# EasyEDA Pro project PRJ_Feeder_V01c.epro, schematic Feeder_Host

## Sheets
1 MCU: Board Name: HostBoard; Create Date: 2025-01-09; Page Name: MCU; Project Name: Orion-Feeder; Schematic Name: Feeder_Host; Update Date: 2025-03-19; Company: Orion Electronics; Drawn: Giovanni C.; Page Size: A4; Version: V0.1d
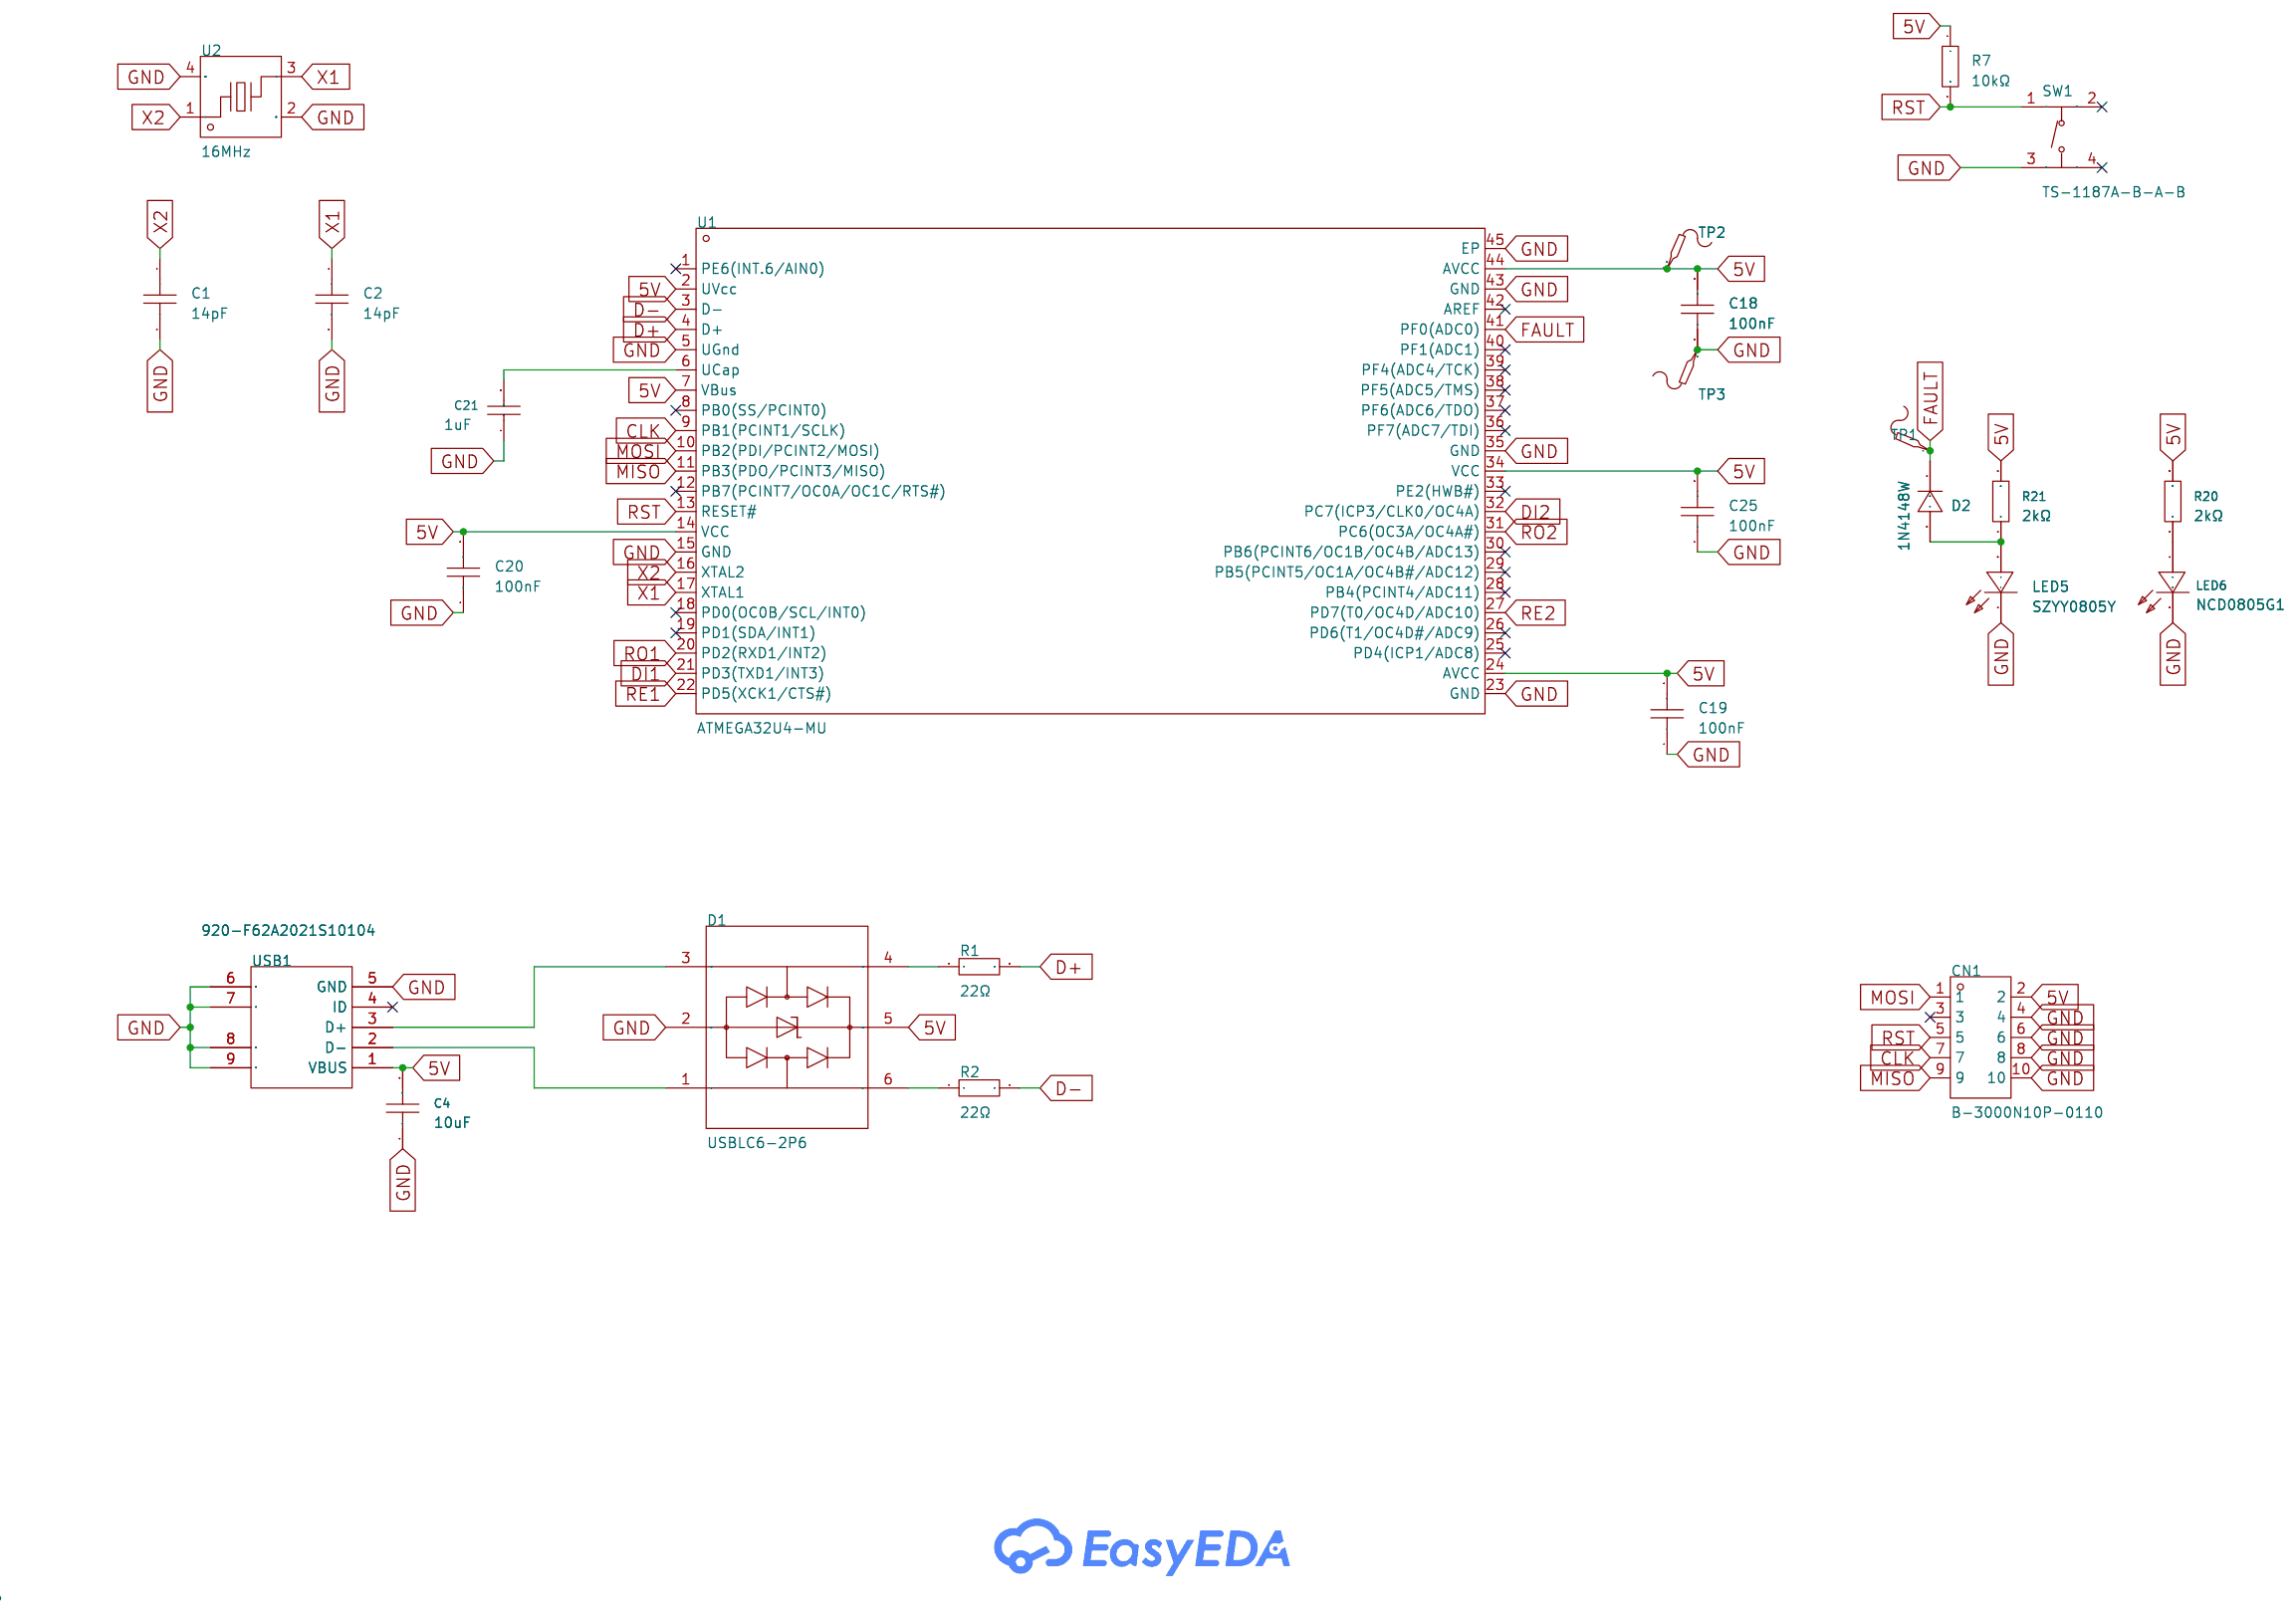
[diagram p2: MCU]
2 485: Page Name: 485; Update Date: 2025-03-21
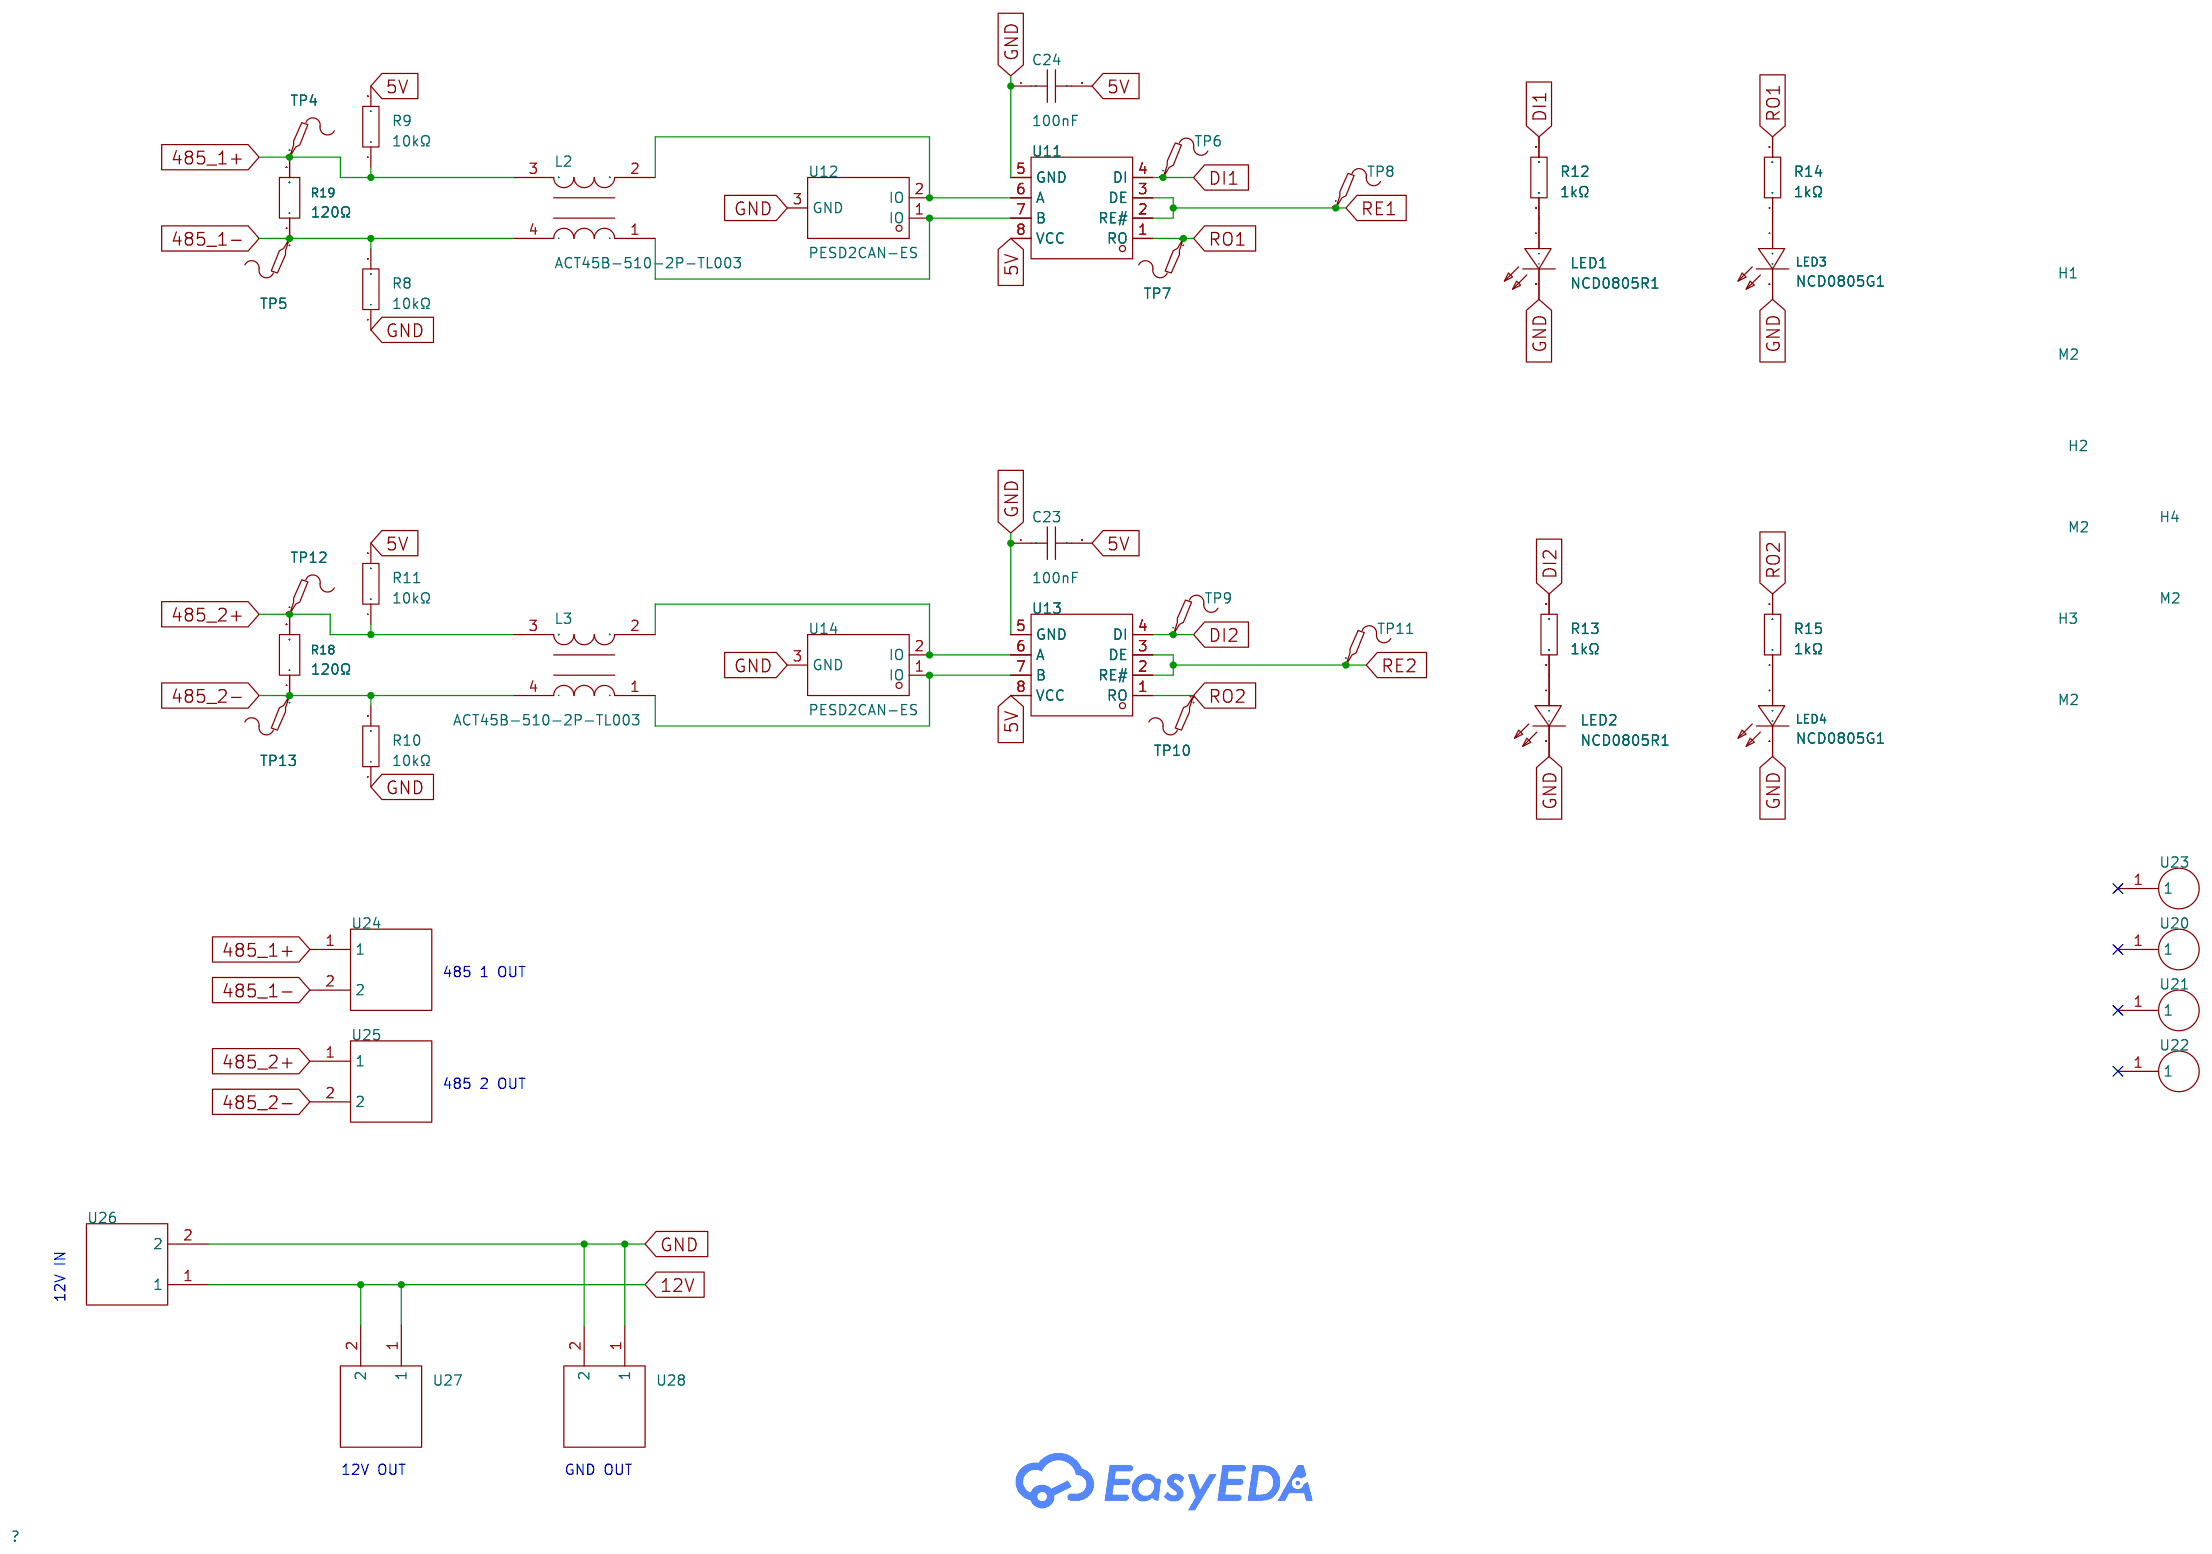
[diagram p3: 485]

## Parts
sheet 485
C23  100nF  [C0402]
C24  100nF  [C0402]
H1  M2  [M2]
H2  M2  [M2]
H3  M2  [M2]
H4  M2  [M2]
L2  ACT45B-510-2P-TL003  [IND-SMD_4P-L4.5-W3.2-TL]
L3  ACT45B-510-2P-TL003  [IND-SMD_4P-L4.5-W3.2-TL]
LED1  NCD0805R1  [LED0805-R-RD]
LED2  NCD0805R1  [LED0805-R-RD]
LED3  NCD0805G1  [LED0805-R-RD]
LED4  NCD0805G1  [LED0805-R-RD]
R8  10kΩ  [R0402]
R9  10kΩ  [R0402]
R10  10kΩ  [R0402]
R11  10kΩ  [R0402]
R12  1kΩ  [R0402]
R13  1kΩ  [R0402]
R14  1kΩ  [R0402]
R15  1kΩ  [R0402]
R18  120Ω  [R0402]
R19  120Ω  [R0402]
TP4  -  [Test-Point-0.5mm]
TP5  -  [Test-Point-0.5mm]
TP6  -  [Test-Point-0.5mm]
TP7  -  [Test-Point-0.5mm]
TP8  -  [Test-Point-0.5mm]
TP9  -  [Test-Point-0.5mm]
TP10  -  [Test-Point-0.5mm]
TP11  -  [Test-Point-0.5mm]
TP12  -  [Test-Point-0.5mm]
TP13  -  [Test-Point-0.5mm]
U11  MAX1487EDTR(XBLW)  [SOP-8_L4.9-W3.9-P1.27-LS6.0-BL]
U12  PESD2CAN-ES  [SOT-23-3_L2.9-W1.3-P1.90-LS2.4-BR]
U13  MAX1487EDTR(XBLW)  [SOP-8_L4.9-W3.9-P1.27-LS6.0-BL]
U14  PESD2CAN-ES  [SOT-23-3_L2.9-W1.3-P1.90-LS2.4-BR]
U20  -  [FID_CUST]
U21  -  [FID_CUST]
U22  -  [FID_CUST]
U23  -  [FID_CUST]
U24  -  [Wago 2060-472/998-404]
U25  -  [Wago 2060-472/998-404]
U26  -  [Wago 2060-472/998-404]
U27  -  [Wago 2060-472/998-404]
U28  -  [Wago 2060-472/998-404]
sheet MCU
C1  14pF  [C0805]
C2  14pF  [C0805]
C4  10uF  [C0603]
C18  100nF  [C0402]
C19  100nF  [C0402]
C20  100nF  [C0402]
C21  1uF  [C0805]
C25  100nF  [C0402]
CN1  B-3000N10P-0110  [CONN-SMD_10P-P2.54_B-3000N10P-0110]
D1  USBLC6-2P6  [SOT-666-6_L1.6-W1.2-P0.50-LS1.6-BR]
D2  1N4148W  [SOD-123_L2.8-W1.8-LS3.7-RD]
LED5  SZYY0805Y  [LED0805-RD_YELLOW]
LED6  NCD0805G1  [LED0805-R-RD]
R1  22Ω  [R0805]
R2  22Ω  [R0805]
R7  10kΩ  [R0402]
R20  2kΩ  [R0805]
R21  2kΩ  [R0805]
SW1  TS-1187A-B-A-B  [SW-SMD_4P-L5.1-W5.1-P3.70-LS6.5-TL_H1.5]
TP1  -  [Test-Point-0.5mm]
TP2  -  [Test-Point-0.5mm]
TP3  -  [Test-Point-0.5mm]
U1  ATMEGA32U4-MU  [VQFN-44_L7.0-W7.0-P0.50-BL-EP5.2]
U2  16MHz  [CRYSTAL-SMD_4P-L2.0-W1.6-BL]
USB1  920-F62A2021S10104  [MINI-USB-SMD_920-F62A2021S10104]

## Library data of the parts
C18-C20 C23-C25 = 0402X104K500CT: Capacitance: Tolerance:±10% Tolerance:±10% Voltage Rated: Temperature Coefficient:; LCSC Part Name: 100nF ±10% 50V; Supplier Part: C387959; Manufacturer: Walsin(华新科); Supplier Footprint: 0402; JLCPCB Part Class: Extended Part; Datasheet: https://atta.szlcsc.com/upload/public/pdf/source/20190524/C388053_0CD3F469255EF43E616A57DAC128F58D.pdf; Supplier: LCSC; Tolerance: ±10%
H1-H4 = M2
L2 L3 = ACT45B-510-2P-TL003: Number of Lines:2 Withstanding Voltage:250V@2secs Current Rating:200mA Inductance @ Frequency:51uH@100kHz Voltage Rating - DC:50V Voltage Rating:- Impedance @ Frequency:2.8kΩ@10MHz DC Resistance (DCR):1Ω Operating Temperature:-40℃~+150℃ Operating Temperat; LCSC Part Name: 两路 4532共模滤波器 阻抗2.8kΩ@10MHz; Supplier Part: C76584; Manufacturer: TDK; Supplier Footprint: SMD,4.5x3.2mm; JLCPCB Part Class: Extended Part; Datasheet: https://atta.szlcsc.com/upload/public/pdf/source/20160918/1474166842057.pdf; Supplier: LCSC; Number of Lines: 2; Withstanding Voltage: 250V@2secs; Current Rating: 200mA; Inductance @ Frequency: 51uH@100kHz; Voltage Rating - DC: 50V; Impedance @ Frequency: 2.8kΩ@10MHz; DC Resistance (DCR): 1Ω; Operating Temperature: -40℃~+150℃
LED1 LED2 = NCD0805R1_C84256: Lamp Holder Type:- Emitted Color:Red Forward Voltage (VF):1.6V~2.6V Forward Voltage (VF):1.6V~2.6V Power Dissipation:65mW Forward Current:20mA Dominant Wavelength:615nm~630nm Dominant Wavelength:615nm~630nm Peak Wavelength:- Diode Configuration:独立二极管 Lens; Supplier Part: C84256; Manufacturer: 国星光电; Supplier Footprint: 0805; JLCPCB Part Class: Basic Part; Datasheet: https://atta.szlcsc.com/upload/public/pdf/source/20200820/C84256_F0A75A43B3EAD75808600A0514C76B99.pdf; Supplier: LCSC; Emitted Color: Red; Forward Voltage (VF): 1.6V~2.6V; Power Dissipation: 65mW; Forward Current: 20mA; Dominant Wavelength: 615nm~630nm; Diode Configuration: 独立二极管; Lens Color: 无色透明透镜; Luminous Intensity: 67mcd~195mcd; Viewing Angle: 130°; Operating Temperature: -30℃~+85℃
LED3 LED4 LED6 = NCD0805G1: Emitted Color:Emerald Forward Voltage (VF):2.5V~3.6V Forward Voltage (VF):2.5V~3.6V Power Dissipation:72mW Forward Current:5mA Dominant Wavelength:525nm~537.5nm Dominant Wavelength:525nm~537.5nm Lens Color:无色透明透镜 Luminous Intensity:180mcd~400mcd Luminous; Supplier Part: C84260; Manufacturer: 国星光电; Supplier Footprint: 0805; JLCPCB Part Class: Extended Part; Datasheet: https://atta.szlcsc.com/upload/public/pdf/source/20200820/C84260_AFC7BF57C6FBA034D182BB8D10A67EFE.pdf; Supplier: LCSC; Emitted Color: Emerald; Forward Voltage (VF): 2.5V~3.6V; Power Dissipation: 72mW; Forward Current: 5mA; Dominant Wavelength: 525nm~537.5nm; Lens Color: 无色透明透镜; Luminous Intensity: 180mcd~400mcd; Viewing Angle: 130°; Operating Temperature: -30℃~+85℃
R7-R11 = RC0402FR-0710KL: Type:Thick Film Resistors Resistance: Tolerance:±1% Tolerance:±1% Power(Watts): Overload Voltage (Max): Temperature Coefficient:±100ppm/℃ Temperature Coefficient:±100ppm/℃ Operating Temperature Range:-55℃~+155℃ Operating Temperature Range:-55℃~+155℃; LCSC Part Name: 厚膜电阻 10kΩ ±1% 62.5mW; Supplier Part: C60490; Manufacturer: YAGEO(国巨); Supplier Footprint: 0402; JLCPCB Part Class: Extended Part; Datasheet: https://atta.szlcsc.com/upload/public/pdf/source/20170925/C131467_1506321478108990263.pdf; Supplier: LCSC; Type: Thick Film Resistors; Tolerance: ±1%; Temperature Coefficient: ±100ppm/℃; Operating Temperature Range: -55℃~+155℃
R12-R15 = RC0402FR-071KL: Type:Thick Film Resistors Resistance: Tolerance:±1% Tolerance:±1% Power(Watts): Overload Voltage (Max): Temperature Coefficient:±100ppm/℃ Temperature Coefficient:±100ppm/℃ Operating Temperature Range:-55℃~+155℃ Operating Temperature Range:-55℃~+155℃; LCSC Part Name: 厚膜电阻 1kΩ ±1% 62.5mW; Supplier Part: C106235; Manufacturer: YAGEO(国巨); Supplier Footprint: 0402; JLCPCB Part Class: Extended Part; Datasheet: https://atta.szlcsc.com/upload/public/pdf/source/20180927/C295883_E8D83085EA81BD7DE0B2B681138C15EE.pdf; Supplier: LCSC; Type: Thick Film Resistors; Tolerance: ±1%; Temperature Coefficient: ±100ppm/℃; Operating Temperature Range: -55℃~+155℃
R18 R19 = ERJ2GEJ121X: Type:Thick Film Resistors Resistance: Tolerance:±5% Tolerance:±5% Power(Watts): Overload Voltage (Max):- Temperature Coefficient:±200ppm/℃ Temperature Coefficient:±200ppm/℃ Operating Temperature Range:-55℃~+155℃ Operating Temperature Range:-55℃~+155℃; LCSC Part Name: 120Ω ±5% 100mW 厚膜电阻; Supplier Part: C412974; Manufacturer: PANASONIC(松下); Supplier Footprint: 0402; JLCPCB Part Class: Extended Part; Datasheet: https://atta.szlcsc.com/upload/public/pdf/source/20190820/C412974_078D0C135EE48A01219A288E454FDF0F.pdf; Supplier: LCSC; Type: Thick Film Resistors; Tolerance: ±5%; Temperature Coefficient: ±200ppm/℃; Operating Temperature Range: -55℃~+155℃
TP1-TP13 = Test-Point: Test Point 测试点
U11 U13 = MAX1487EDTR(XBLW): LCSC Part Name: XBLW MAX1487 12 Mbps通信收发器; Supplier Part: C41369526; Manufacturer: XBLW(芯伯乐); Supplier Footprint: SOP-8; Datasheet: https://atta.szlcsc.com/upload/public/pdf/source/20240826/373ADB85BB75A28C97F383EDEA6A9A3C.pdf; Supplier: LCSC
U12 U14 = PESD2CAN-ES: polarity:Bidirectional Reverse Stand-Off Voltage (Vrwm):24V Maximum Clamping Voltage:48V Peak Pulse Current (Ipp):8A Peak Pulse Power Dissipation (Ppp):450W Breakdown Voltage:26.5V Reverse Leakage Current (Ir):1uA Number of Lines:Dual channel Operating Te; LCSC Part Name: CAN 防护，两路双向ESD静电防护器件，30kV，CJ：15pF；CAN/CANFD/12V、24V电源防护; Supplier Part: C5180299; Manufacturer: ElecSuper(静芯微); Supplier Footprint: SOT-23; JLCPCB Part Class: Extended Part; Datasheet: https://atta.szlcsc.com/upload/public/pdf/source/20240905/8813EF6117DE3CA11E16DC4758DF48B3.pdf; Supplier: LCSC; polarity: Bidirectional; Reverse Stand-Off Voltage (Vrwm): 24V; Maximum Clamping Voltage: 48V; Peak Pulse Current (Ipp): 8A; Peak Pulse Power Dissipation (Ppp): 450W; Breakdown Voltage: 26.5V; Reverse Leakage Current (Ir): 1uA; Number of Lines: Dual channel; Type: ESD
U20-U23 = FID_CUST: Custom 1MM fiducial
U24-U28 = WAGO 2060-472/998-404
C1 C2 = CAP_0805: Supplier Footprint: 0805; LCSC Part Name: C519919; Manufacturer Part: CC0805JRNPO9BN140
C4 = GRM188R61E106KA73D: Capacitance: Tolerance:±10% Tolerance:±10% Voltage Rated: Temperature Coefficient:; LCSC Part Name: 10uF ±10% 25V; Supplier Part: C344022; Manufacturer: muRata(村田); Supplier Footprint: 0603; JLCPCB Part Class: Extended Part; Datasheet: https://atta.szlcsc.com/upload/public/pdf/source/20181211/C344022_BB98D43E7DA95E5A749FBFE073C8A3E0.pdf; Supplier: LCSC; Tolerance: ±10%
C21 = CL21B105KOFNNNE: Capacitance: Tolerance:±10% Tolerance:±10% Voltage Rated: Temperature Coefficient:; LCSC Part Name: 1uF ±10% 16V; Supplier Part: C24123; Manufacturer: SAMSUNG(三星); Supplier Footprint: 0805; JLCPCB Part Class: Extended Part; Datasheet: https://atta.szlcsc.com/upload/public/pdf/source/20160218/1457707763339.pdf; Supplier: LCSC; Tolerance: ±10%
CN1 = B-3000N10P-0110: Connector Type:简牛座 Pitch:2.54mm Structure:2x5P Holder Type:Brick nogging Row Spacing:2.54mm Number of Rows:2 Pin Number in each Row:5 Contact Material:Brass Contact Plating:-; LCSC Part Name: 2.54mm 2x5P 排数:2 每排P数:5; Supplier Part: C383605; Manufacturer: Ckmtw(灿科盟); Supplier Footprint: SMD,P=2.54mm; JLCPCB Part Class: Extended Part; Datasheet: https://atta.szlcsc.com/upload/public/pdf/source/20210819/EF893D1E70FA66E68F7407481BD50F8A.pdf; Supplier: LCSC; Connector Type: 简牛座; Pitch: 2.54mm; Structure: 2x5P; Holder Type: Brick nogging; Row Spacing: 2.54mm; Number of Rows: 2; Pin Number in each Row: 5; Contact Material: Brass
D1 = USBLC6-2P6_C15999: polarity:Unidirectional Reverse Stand-Off Voltage (Vrwm):5.25V Maximum Clamping Voltage:17V Peak Pulse Current (Ipp):5A Breakdown Voltage:6V Number of Lines:Dual channel Type:ESD; LCSC Part Name: 单向ESD; Supplier Part: C15999; Manufacturer: ST(意法半导体); Supplier Footprint: SOT-666-6; JLCPCB Part Class: Extended Part; Datasheet: https://atta.szlcsc.com/upload/public/pdf/source/20140724/1457707160627.pdf; Supplier: LCSC; polarity: Unidirectional; Reverse Stand-Off Voltage (Vrwm): 5.25V; Maximum Clamping Voltage: 17V; Peak Pulse Current (Ipp): 5A; Breakdown Voltage: 6V; Number of Lines: Dual channel; Type: ESD
D2 = 1N4148W_C84367: Diode Configuration: Forward Voltage (Vf@If):1.5V@300mA Reverse Voltage (Vr): Rectified Current: Reverse Leakage Current:25nA@20V Reverse Recovery Time (trr): Operating Temperature:- Operating Temperature:-; LCSC Part Name: 电压:100V 电流:300mA; Supplier Part: C84367; Manufacturer: MDD(辰达半导体); Supplier Footprint: SOD-123; JLCPCB Part Class: Extended Part; Datasheet: https://atta.szlcsc.com/upload/public/pdf/source/20230823/B01BF36E6140A0359364F9F682D146D6.pdf; Supplier: LCSC; Forward Voltage (Vf@If): 1.5V@300mA; Reverse Leakage Current: 25nA@20V
LED5 = SZYY0805Y: Emitted Color:Yellow Power Dissipation:40mW Forward Current:10mA Dominant Wavelength:584nm~594nm Dominant Wavelength:584nm~594nm Peak Wavelength:596nm Diode Configuration:- Lens Color:无色透明透镜 Color Temperature:- Color Temperature:- Viewing Angle:120° Mount; LCSC Part Name: 黄灯; Supplier Part: C434436; Manufacturer: yongyu(永裕光电); Supplier Footprint: 0805; JLCPCB Part Class: Extended Part; Datasheet: https://atta.szlcsc.com/upload/public/pdf/source/20191204/C434436_DD3F69F670EA5C3EF8F92D3BC1EA8D03.pdf; Supplier: LCSC; Emitted Color: Yellow; Power Dissipation: 40mW; Forward Current: 10mA; Dominant Wavelength: 584nm~594nm; Peak Wavelength: 596nm; Lens Color: 无色透明透镜; Viewing Angle: 120°; Operating Temperature: -40℃~+85℃
R1 R2 = RC0805JR-0722RL: Type:Thick Film Resistors Resistance: Tolerance:±5% Tolerance:±5% Power(Watts): Overload Voltage (Max): Temperature Coefficient:±100ppm/℃ Temperature Coefficient:±100ppm/℃ Operating Temperature Range:-55℃~+155℃ Operating Temperature Range:-55℃~+155℃; LCSC Part Name: 厚膜电阻 22Ω ±5% 125mW; Supplier Part: C108406; Manufacturer: YAGEO(国巨); Supplier Footprint: 0805; JLCPCB Part Class: Extended Part; Datasheet: https://atta.szlcsc.com/upload/public/pdf/source/20180821/C275644_0D56F95EFF785E7D9A1FEF436B37DA78.pdf; Supplier: LCSC; Type: Thick Film Resistors; Tolerance: ±5%; Temperature Coefficient: ±100ppm/℃; Operating Temperature Range: -55℃~+155℃
R20 R21 = 0805W8F2001T5E: Type:Thick Film Resistors Resistance:2kΩ Tolerance:±1% Tolerance:±1% Power(Watts): Overload Voltage (Max): Temperature Coefficient:±100ppm/℃ Temperature Coefficient:±100ppm/℃ Operating Temperature Range:-55℃~+155℃ Operating Temperature Range:-55℃~+155℃; LCSC Part Name: 2kΩ ±1% 125mW 厚膜电阻; Supplier Part: C17604; Manufacturer: UNI-ROYAL(厚声); Supplier Footprint: 0805; JLCPCB Part Class: Basic Part; Datasheet: https://atta.szlcsc.com/upload/public/pdf/source/20200306/C422600_1E6D84923E4A46A82E41ADD87F860B5C.pdf; Supplier: LCSC; Type: Thick Film Resistors; Tolerance: ±1%; Temperature Coefficient: ±100ppm/℃; Operating Temperature Range: -55℃~+155℃
SW1 = TS-1187A-B-A-B: Circuit:SPST Actuator Style:Round Button Operating Force:160gf Mounting Style:Brick nogging Switch Length:5.1mm Switch Width:5.1mm Switch Height:1.5mm Strike Gundam:不带 Contact Current:50mA Voltage Rating (DC):12V Insulation Resistance:- Actuator/Cap Color; LCSC Part Name: 5.1*5.1*1.5mm 立贴 轻触开关; Supplier Part: C318884; Manufacturer: XKB Connectivity(中国星坤); Supplier Footprint: SMD; JLCPCB Part Class: Basic Part; Datasheet: https://atta.szlcsc.com/upload/public/pdf/source/20200227/C318890_053E50208A88A7BA1965D8746000774E.pdf; Supplier: LCSC; Circuit: SPST; Actuator Style: Round Button; Operating Force: 160gf; Mounting Style: Brick nogging; Switch Length: 5.1mm; Switch Width: 5.1mm; Switch Height: 1.5mm; Strike Gundam: 不带; Contact Current: 50mA; Voltage Rating (DC): 12V; Actuator/Cap Color: 金色; With Lamp: No; Mechanical Life: 10万次; Operating Temperature: -30℃~+85℃
U1 = ATMEGA32U4-MU: CPU Core:AVR Program Storage Size:32KB RAM Size:2.5KB GPIO Ports Number:26 Operating Voltage Range:2.7V~5.5V Operating Voltage Range:2.7V~5.5V CPU Maximum Speed:16MHz Program Memory Type:FLASH EEPROM:1KB Operating Temperature Range:-40℃~+85℃ Operating Tem; Supplier Part: C112161; Manufacturer: MICROCHIP(美国微芯); Supplier Footprint: VQFN-44-EP(7x7); JLCPCB Part Class: Extended Part; Datasheet: https://atta.szlcsc.com/upload/public/pdf/source/20170515/1494827289828.pdf; Supplier: LCSC; CPU Core: AVR; Program Storage Size: 32KB; RAM Size: 2.5KB; GPIO Ports Number: 26; Operating Voltage Range: 2.7V~5.5V; CPU Maximum Speed: 16MHz; Program Memory Type: FLASH; EEPROM: 1KB; Operating Temperature Range: -40℃~+85℃; ADC (Bit): 10bit; Universal Serial Bus: 有; Peripheral/Function: WDT；PWM；WDT；PWM; Watchdog: 有; Low-Voltage Detect: 有; Internal Oscillator: 有
U2 = X201616MOB4SI: Crystal Type:Surface Mount Crystal Frequency: Normal temperature Frequency Tolerance:±10ppm Normal temperature Frequency Tolerance:±10ppm External load capacitor: Frequency Stability(Full temperature range):±20ppm Frequency Stability(Full temperature rang; LCSC Part Name: 16MHz ±10ppm 12pF; Supplier Part: C2682778; Manufacturer: YXC(扬兴晶振); Supplier Footprint: SMD2016-4P; JLCPCB Part Class: Extended Part; Datasheet: https://atta.szlcsc.com/upload/public/pdf/source/20240329/C26C9A15A73CBCFBF373B30A8E126750.pdf; Supplier: LCSC; Crystal Type: Surface Mount Crystal; Normal temperature Frequency Tolerance: ±10ppm; Frequency Stability(Full temperature range): ±20ppm
USB1 = 920-F62A2021S10104: Connector Type:Micro-B Standard:USB 2.0 Gender:Female Number of Ports:1 Number of Contacts:5P Mounting Style:Sink board Current Rating - Power (Max):- Operating Temperature Range:-30℃~+80℃ Operating Temperature Range:-30℃~+80℃; LCSC Part Name: Micro-B 母 沉板; Supplier Part: C2763184; Manufacturer: 精拓金; Supplier Footprint: SMD; JLCPCB Part Class: Extended Part; Datasheet: https://atta.szlcsc.com/upload/public/pdf/source/20210526/C2763184_A4A31A8A3654792FCCA6A1F5A5406E81.pdf; Supplier: LCSC; Connector Type: Micro-B; Standard: USB 2.0; Gender: Female; Number of Ports: 1; Number of Contacts: 5P; Mounting Style: Sink board; Operating Temperature Range: -30℃~+80℃

## Nets
5V: C4.2 C18.2 C19.2 C20.2 C23.2 C24.2 C25.2 CN1.2 D1.5(VBUS) R7.1 R9.2 R11.2 R20.2 R21.2 TP2.1 U1.2(UVcc) U1.7(VBus) U1.14(VCC) U1.24(AVCC) U1.34(VCC) U1.44(AVCC) U11.8(VCC) U13.8(VCC) USB1.1(VBUS)
12V: U26.1 U27.1 U27.2
GND: C1.2 C2.2 C4.1 C18.1 C19.1 C20.1 C21.1 C23.1 C24.1 C25.1 CN1.4 CN1.6 CN1.8 CN1.10 D1.2(GND) LED1.2(-) LED2.2(-) LED3.2(K) LED4.2(K) LED5.1(-) LED6.2(K) R8.1 R10.1 SW1.3(C) TP3.1 U1.5(UGnd) U1.15(GND) U1.23(GND) U1.35(GND) U1.43(GND) U1.45(EP) U2.2(GND) U2.4(GND) U11.5(GND) U12.3(GND) U13.5(GND) U14.3(GND) U26.2 U28.1 U28.2 USB1.5(GND) USB1.6(EH) USB1.7(EH) USB1.8(EH) USB1.9(EH)
485_1+: L2.3 R9.1 R19.2 TP4.1 U24.1
485_1-: L2.4 R8.2 R19.1 TP5.1 U24.2
485_2+: L3.3 R11.1 R18.2 TP12.1 U25.1
485_2-: L3.4 R10.2 R18.1 TP13.1 U25.2
CLK: CN1.7 U1.9(PB1(PCINT1/SCLK))
D+: R1.2 U1.4(D+)
D-: R2.2 U1.3(D-)
DI1: R12.2 TP6.1 U1.21(PD3(TXD1/INT3)) U11.4(DI)
DI2: R13.2 TP9.1 U1.32(PC7(ICP3/CLK0/OC4A)) U13.4(DI)
FAULT: D2.1(C) TP1.1 U1.41(PF0(ADC0))
MISO: CN1.9 U1.11(PB3(PDO/PCINT3/MISO))
MOSI: CN1.1 U1.10(PB2(PDI/PCINT2/MOSI))
RE1: TP8.1 U1.22(PD5(XCK1/CTS#)) U11.2(RE#) U11.3(DE)
RE2: TP11.1 U1.27(PD7(T0/OC4D/ADC10)) U13.2(RE#) U13.3(DE)
RO1: R14.2 TP7.1 U1.20(PD2(RXD1/INT2)) U11.1(RO)
RO2: R15.2 TP10.1 U1.31(PC6(OC3A/OC4A#)) U13.1(RO)
RST: CN1.5 R7.2 SW1.1(A) U1.13(RESET#)
X1: C2.1 U1.17(XTAL1) U2.3
X2: C1.1 U1.16(XTAL2) U2.1
$1N1505: D1.3(I/O2) USB1.3(D+)
$1N1514: D1.1(I/O1) USB1.2(D-)
$1N1660: D1.6(I/O1) R2.1
$1N1664: D1.4(I/O2) R1.1
$1N2192: C21.2 U1.6(UCap)
$1N4732: D2.2(A) LED5.2(+) R21.1
$1N4906: LED6.1(A) R20.1
$2N403: L2.1 U11.7(B) U12.1(IO)
$2N410: L2.2 U11.6(A) U12.2(IO)
$2N418: L3.1 U13.7(B) U14.1(IO)
$2N431: L3.2 U13.6(A) U14.2(IO)
$2N1218: LED1.1(+) R12.1
$2N1337: LED2.1(+) R13.1
$2N1473: LED3.1(A) R14.1
$2N1588: LED4.1(A) R15.1

Not connected (* = marked no-connect by the designer): CN1 3*; SW1 2(B)* 4(D)*; U1 1(PE6(INT.6/AIN0))* 8(PB0(SS/PCINT0))* 12(PB7(PCINT7/OC0A/OC1C/RTS#))* 18(PD0(OC0B/SCL/INT0))* 19(PD1(SDA/INT1))* 25(PD4(ICP1/ADC8))* 26(PD6(T1/OC4D#/ADC9))* 28(PB4(PCINT4/ADC11))* 29(PB5(PCINT5/OC1A/OC4B#/ADC12))* 30(PB6(PCINT6/OC1B/OC4B/ADC13))* 33(PE2(HWB#))* 36(PF7(ADC7/TDI))* 37(PF6(ADC6/TDO))* 38(PF5(ADC5/TMS))* 39(PF4(ADC4/TCK))* 40(PF1(ADC1))* 42(AREF)*; U20 1*; U21 1*; U22 1*; U23 1*; USB1 4(ID)*

## Notes on the sheets
sheet 2
- 485 1 OUT
- 485 2 OUT
- 12V IN
- 12V OUT
- GND OUT
